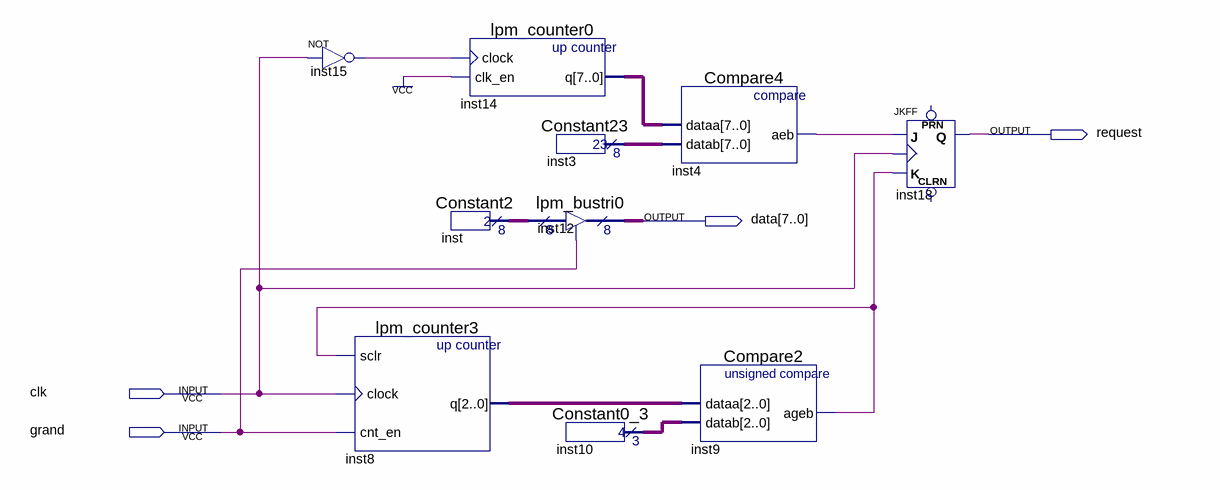
[diagram p0: schematic sheet]
// Quartus schematic Master2.bdf as structural Verilog: 10 symbols, 4 pins
module Master2 (
  input  clk,
  input  grand,
  output request,
  output [7:0] data
);

  wire inst4_aeb, inst9_ageb, inst15_out;
  wire [2:0] inst8_q, inst10_result;
  wire [7:0] inst3_result, inst14_q, inst_result;

  not inst15 (inst15_out, clk);
  lpm_counter3 inst8 (.sclr(inst9_ageb), .clock(clk), .cnt_en(grand), .q(inst8_q));
  lpm_counter0 inst14 (.clock(inst15_out), .clk_en(1'b1), .q(inst14_q));
  Constant2 inst (.result(inst_result));
  lpm_bustri0 inst12 (.enabledt(grand), .data(inst_result), .tridata(data));
  Constant23 inst3 (.result(inst3_result));
  Constant0_3 inst10 (.result(inst10_result));
  Compare4 inst4 (.dataa(inst14_q), .datab(inst3_result), .aeb(inst4_aeb));
  Compare2 inst9 (.dataa(inst8_q), .datab(inst10_result), .ageb(inst9_ageb));
  JKFF inst18 (.K(inst9_ageb), .J(inst4_aeb), .CLK(clk), .Q(request));  // open: PRN, CLRN
endmodule
